# EAGLE design GC+ (EAGLE 7.4.0)
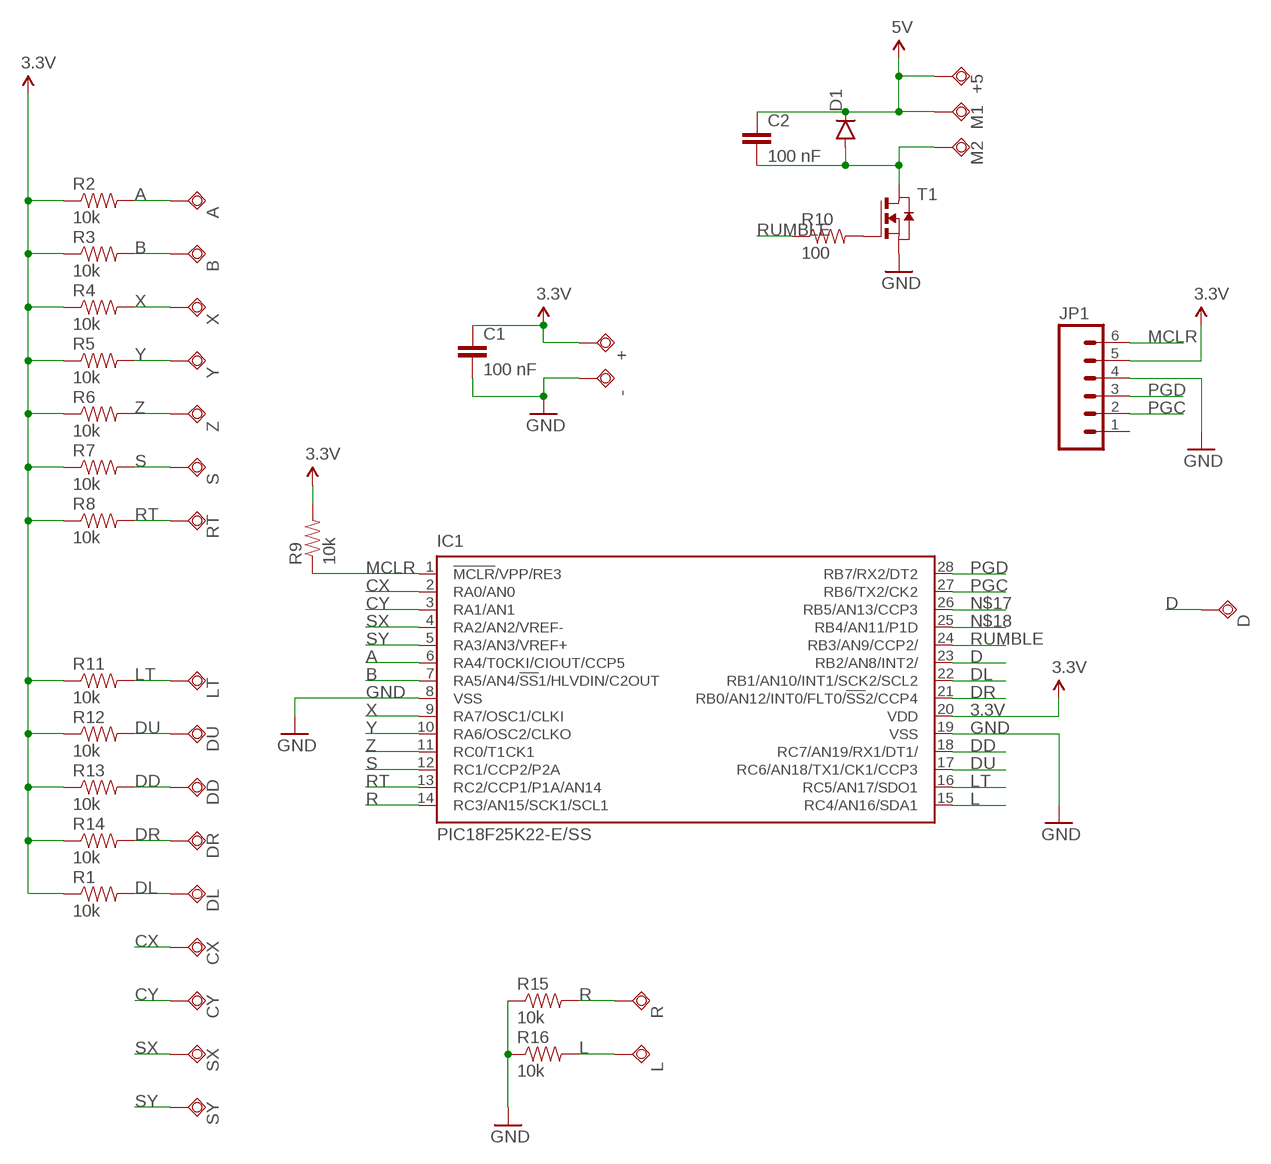
[diagram p0: schematic, sheet 1]

## Parts
+  TPSQTP10SQ  [TP10SQ]
+5  TPSQTP10SQ  [TP10SQ]
-  TPSQTP10SQ  [TP10SQ]
A  TPSQTP10SQ  [TP10SQ]
B  TPSQTP10SQ  [TP10SQ]
C1  100 nF  CAP0805  [0805]
C2  100 nF  CAP0805  [0805]
CX  TPSQTP10SQ  [TP10SQ]
CY  TPSQTP10SQ  [TP10SQ]
D  TPSQTP10SQ  [TP10SQ]
D1  DIODEBAS16  [SOD-323]
DD  TPSQTP10SQ  [TP10SQ]
DL  TPSQTP10SQ  [TP10SQ]
DR  TPSQTP10SQ  [TP10SQ]
DU  TPSQTP10SQ  [TP10SQ]
IC1  PIC18F25K22-E/SS  [SSOP28]
JP1  M06SILK_FEMALE_PTH  [1X06]
L  TPSQTP10SQ  [TP10SQ]
LT  TPSQTP10SQ  [TP10SQ]
M1  TPSQTP10SQ  [TP10SQ]
M2  TPSQTP10SQ  [TP10SQ]
R  TPSQTP10SQ  [TP10SQ]
R1  10k  RESISTOR0805-RES  [0805]
R2  10k  RESISTOR0805-RES  [0805]
R3  10k  RESISTOR0805-RES  [0805]
R4  10k  RESISTOR0805-RES  [0805]
R5  10k  RESISTOR0805-RES  [0805]
R6  10k  RESISTOR0805-RES  [0805]
R7  10k  RESISTOR0805-RES  [0805]
R8  10k  RESISTOR0805-RES  [0805]
R9  10k  RESISTOR0805-RES  [0805]
R10  100  RESISTOR0805-RES  [0805]
R11  10k  RESISTOR0805-RES  [0805]
R12  10k  RESISTOR0805-RES  [0805]
R13  10k  RESISTOR0805-RES  [0805]
R14  10k  RESISTOR0805-RES  [0805]
R15  10k  RESISTOR0805-RES  [0805]
R16  10k  RESISTOR0805-RES  [0805]
RT  TPSQTP10SQ  [TP10SQ]
S  TPSQTP10SQ  [TP10SQ]
SX  TPSQTP10SQ  [TP10SQ]
SY  TPSQTP10SQ  [TP10SQ]
T1  NMOSSOT23  [SOT-23]
X  TPSQTP10SQ  [TP10SQ]
Y  TPSQTP10SQ  [TP10SQ]
Z  TPSQTP10SQ  [TP10SQ]

## Nets
3.3V: +.TP C1.1 IC1.20(VDD) JP1.5 R1.1 R2.1 R3.1 R4.1 R5.1 R6.1 R7.1 R8.1 R9.2 R11.1 R12.1 R13.1 R14.1
5V: +5.TP C2.1 D1.C M1.TP
A: A.TP IC1.6(RA4/T0CKI/CIOUT/CCP5) R2.2
B: B.TP IC1.7(RA5/AN4/!SS!1/HLVDIN/C2OUT) R3.2
CX: CX.TP IC1.2(RA0/AN0)
CY: CY.TP IC1.3(RA1/AN1)
D: D.TP IC1.23(RB2/AN8/INT2/)
DD: DD.TP IC1.18(RC7/AN19/RX1/DT1/) R13.2
DL: DL.TP IC1.22(RB1/AN10/INT1/SCK2/SCL2) R1.2
DR: DR.TP IC1.21(RB0/AN12/INT0/FLT0/!SS!2/CCP4) R14.2
DU: DU.TP IC1.17(RC6/AN18/TX1/CK1/CCP3) R12.2
GND: -.TP C1.2 IC1.8(VSS) IC1.19(VSS) JP1.4 R15.1 R16.1 T1.2(S)
L: IC1.15(RC4/AN16/SDA1) L.TP R16.2
LT: IC1.16(RC5/AN17/SDO1) LT.TP R11.2
MCLR: IC1.1(!MCLR!/VPP/RE3) JP1.6 R9.1
N$1: R10.2 T1.3(G)
N$3: C2.2 D1.A M2.TP T1.1(D)
N$17: IC1.26(RB5/AN13/CCP3)
N$18: IC1.25(RB4/AN11/P1D)
PGC: IC1.27(RB6/TX2/CK2) JP1.2
PGD: IC1.28(RB7/RX2/DT2) JP1.3
R: IC1.14(RC3/AN15/SCK1/SCL1) R15.2 R.TP
RT: IC1.13(RC2/CCP1/P1A/AN14) R8.2 RT.TP
RUMBLE: IC1.24(RB3/AN9/CCP2/) R10.1
S: IC1.12(RC1/CCP2/P2A) R7.2 S.TP
SX: IC1.4(RA2/AN2/VREF-) SX.TP
SY: IC1.5(RA3/AN3/VREF+) SY.TP
X: IC1.9(RA7/OSC1/CLKI) R4.2 X.TP
Y: IC1.10(RA6/OSC2/CLKO) R5.2 Y.TP
Z: IC1.11(RC0/T1CK1) R6.2 Z.TP
Unconnected: JP1.1

## Library data of the parts
+ +5 - A B CX CY D DD DL DR DU L LT M1 M2 R RT S SX SY X Y Z = testpad:TPSQ: Test pad
C1 C2 = SparkFun-Capacitors:CAP: Capacitor Standard 0603 ceramic capacitor, and 0.1" leaded capacitor.
D1 = SparkFun-DiscreteSemi:DIODE: Diode These are standard reverse protection diodes and small signal diodes. SMA package can handle up to about 1A. SOD-323 can handle about 200mA. What the SOD-323 package when ordering, there are some mfgs out there that are 5-pin packages.; PROD_ID: DIO-09646; VALUE: 250mA/100V
IC1 = pic18f25k22:PIC18F25K22: PIC18F25K22 28 pin DIP
JP1 = SparkFun-Connectors:M06: Header 6 Standard 6-pin 0.1" header. Use with straight break away headers (SKU : PRT-00116), right angle break away headers (PRT-00553), swiss pins (PRT-00743), machine pins (PRT-00117), and female headers (PRT-00115). Molex polarized connector foot print use with SKU : PRT-08094 with associated crimp pins and housings. NOTES ON THE VARIANTS LOCK and LOCK_LONGPADS... This footprint was designed to help hold the alignment of a through-hole component (i.e. 6-pin header) while soldering it into place. You may notice that each hole has been shifted either up or down by 0.005 of an inch from it's more standard position (which is a perfectly straight line). This slight alteration caused the pins (the squares in the middle) to touch the edges of the holes. Because they are alternating, it causes a "brace" to hold the component in place. 0.005 has proven to be the perfect amount of "off-center" position when using our standard breakaway headers. Although looks a little odd when you look at the bare footprint, once you have a header in there, the alteration is very hard to notice. Also,if you push a header all the way into place, it is covered up entirely on the bottom side. This idea of altering the position of holes to aid alignment will be further integrated into the Sparkfun Library for other footprints. It can help hold any component with 3 or more connection pins.; PROD_ID: CONN-08437
R1-R16 = SparkFun-Passives:RESISTOR: Resistor Basic schematic elements and footprints for 0603, 1206, and PTH resistors.
T1 = zetex:NMOSSOT23: MOS FET; OC_FARNELL: unknown; OC_NEWARK: unknown

## Board
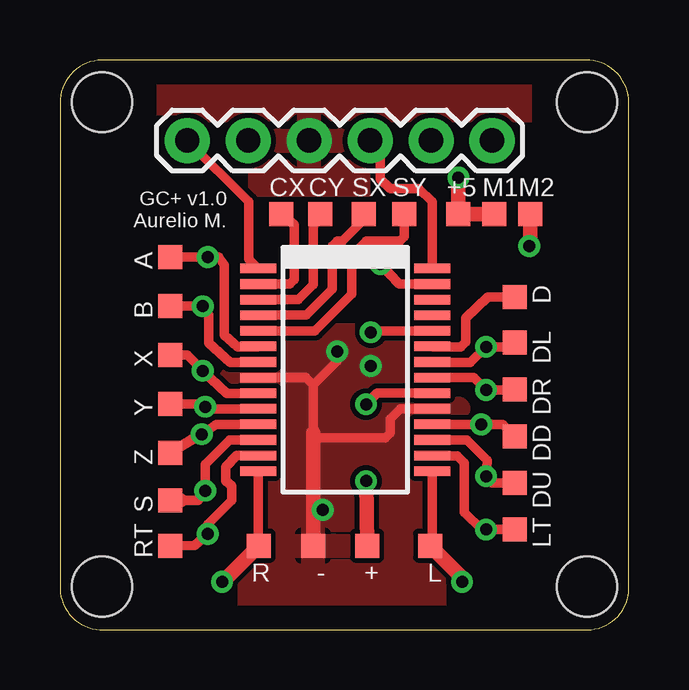
[diagram p1: board, top side]
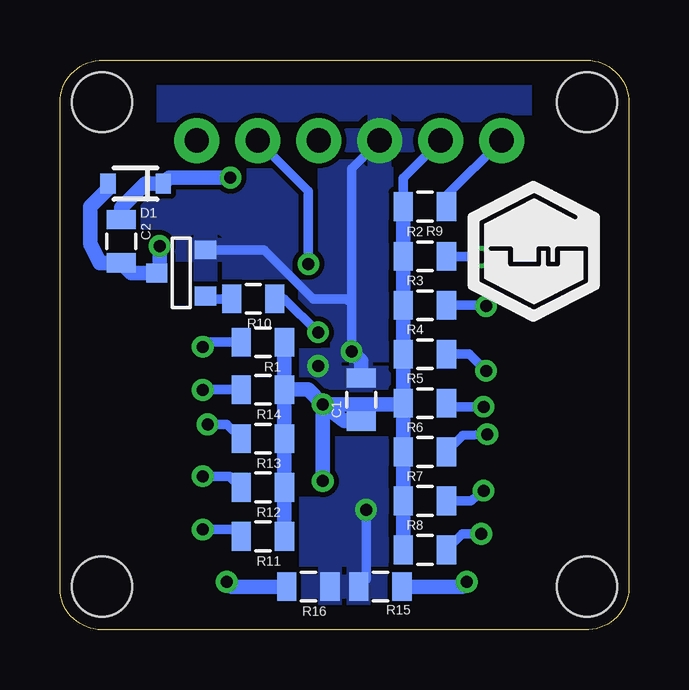
[diagram p2: board, bottom side, seen from below]

Size 23.7 x 23.76 mm. Coordinates in mm from the lower left corner, seen from the top.
Outline: 0,21.95 0,1.86 arc90 1.66,0 21.97,0 arc90 23.7,1.73 23.7,22.14 arc90 21.74,23.75 1.75,23.75 arc90 0,21.95
Copper layers (1*16): Top 0.035mm / dielectric 1.5mm / Bottom 0.035mm
Design rules "default *": minimum track width 10mil, minimum drill 24mil, track to track 8mil, track to pad 8mil, pad to pad 8mil, via to via 8mil, smd to smd 8mil, copper to edge 40mil, drill to drill 8mil, minimum pad ring 10mil, minimum via ring 8mil, stop-mask expansion 4mil, vias tented up to drill 20mil, thermal gap 10mil
Holes 2.5 mm at 21.95,22 1.75,22 1.75,1.8 21.95,1.8

### Footprints (pad centres in the part's own frame; a part is rotated, then mirrored left to right if it is on the bottom)
TP10SQ = smd 1 x 1: TP 0,0
0805 = smd 0.8 x 1.2: 1 -0.9,0; 2 0.9,0
SOD-323 = smd 0.63 x 0.83: A 1.15,0; C -1.15,0
SSOP28 = smd 0.4 x 1.5: 1 -4.225,-3.625; 2 -3.575,-3.625; 3 -2.925,-3.625; 4 -2.275,-3.625; 5 -1.625,-3.625; 6 -0.975,-3.625; 7 -0.325,-3.625; 8 0.325,-3.625; 9 0.975,-3.625; 10 1.625,-3.625; 11 2.275,-3.625; 12 2.925,-3.625; 13 3.575,-3.625; 14 4.225,-3.625; 15 4.225,3.625; 16 3.575,3.625; 17 2.925,3.625; 18 2.275,3.625; 19 1.625,3.625; 20 0.975,3.625; 21 0.325,3.625; 22 -0.325,3.625; 23 -0.975,3.625; 24 -1.625,3.625; 25 -2.275,3.625; 26 -2.925,3.625; 27 -3.575,3.625; 28 -4.225,3.625
1X06 = drill 1.016 pad 1.88: 1 0,0; 2 2.54,0; 3 5.08,0; 4 7.62,0; 5 10.16,0; 6 12.7,0
SOT-23 = smd 0.787 x 0.889: 1 0.025,-1.016; 2 -0.94,1.016; 3 0.991,1.016

### Placement (x,y rotation side)
+  12.8,3.5 180 top
+5  16.6,17.33 0 top
-  10.55,3.5 180 top
A  4.6,15.54 90 top
B  4.6,13.49 90 top
C1  11.15,9.6 90 bottom
C2  21.15,16.2 270 bottom
CX  9.21,17.33 0 top
CY  10.85,17.33 0 top
D  18.95,13.87 270 top
D1  20.55,18.6 180 bottom
DD  18.95,8.06 270 top
DL  18.95,11.97 270 top
DR  18.95,10.02 270 top
DU  18.95,6.12 270 top
IC1  11.88,10.84 270 top
JP1  18,20.4 180 top
L  15.42,3.5 180 top
LT  18.95,4.18 270 top
M1  18.1,17.33 0 top
M2  19.6,17.33 0 top
R  8.27,3.5 180 top
R1  15.25,11.99 180 bottom
R2  8.5,15.57 0 bottom
R3  8.5,13.53 0 bottom
R4  8.5,11.49 0 bottom
R5  8.5,9.45 0 bottom
R6  8.5,7.41 0 bottom
R7  8.5,5.37 0 bottom
R8  8.5,3.33 0 bottom
R9  8.5,17.65 180 bottom
R10  15.65,13.8 180 bottom
R11  15.25,3.89 180 bottom
R12  15.25,5.93 180 bottom
R13  15.25,7.97 180 bottom
R14  15.25,10.01 180 bottom
R15  10.35,1.8 0 bottom
R16  13.35,1.8 180 bottom
RT  4.6,3.5 90 top
S  4.6,5.39 90 top
SX  12.66,17.33 0 top
SY  14.35,17.33 0 top
T1  18.65,14.9 270 bottom
U$1  [LOGOGC]  4.05,15.7 0 top
X  4.6,11.45 90 top
Y  4.6,9.41 90 top
Z  4.6,7.37 90 top

### Tracks (layer width: path | path; a pad name or v marks a point on that pad's centre or on a via)
3.3V  (via drill 0.5)
  Top 0.4: v12.75,9.4 13.22,9.86 IC1.20
  Top 0.61: +.TP v12.75,6.2
  Bottom 0.4: JP1.5 9.4,18.84 R9.2
  Bottom 0.61: R14.1 13.36,10.01 v12.75,9.4 | R8.1 R7.1 R6.1 R5.1 | R5.1 R4.1 R3.1 R2.1 R9.2 | R12.1 R11.1 R13.1 R14.1 | v12.75,9.4 9.45,9.4 R5.1 | v12.75,6.2 v12.75,9.4 | C1.1 11.85,8.7 v12.75,9.4 | R1.1 R14.1
5V  (via drill 0.5)
  Top 0.6: +5.TP v16.6,18.85
  Top 0.61: M1.TP +5.TP
  Bottom 0.6: v16.6,18.85 19.15,18.85 D1.C 20.15,18.6 21.15,17.6 C2.1
A  (via drill 0.5)
  Top 0.4: IC1.6 8.24,11.8 7.4,11.8 6.85,12.3 6.85,15.2 6.61,15.54 v6.15,15.54 A.TP
  Bottom 0.4: R2.2 6.18,15.57 v6.15,15.54
B  (via drill 0.5)
  Top 0.4: IC1.7 8.17,11.15 7.1,11.15 6.2,11.95 6.2,13.15 6.06,13.49 v5.95,13.49 B.TP
  Bottom 0.4: R3.2 5.99,13.53 v5.95,13.49
CX
  Top 0.4: CX.TP 9.75,16.89 9.75,14.6 9.57,14.41 IC1.2
CY
  Top 0.4: CY.TP 10.55,16.83 10.55,14.4 9.92,13.77 IC1.3
D
  Top 0.4: D.TP 17.82,13.87 16.9,13 16.9,12 16.7,11.8 15.52,11.8 IC1.23
DD  (via drill 0.5)
  Top 0.4: IC1.18 v17.55,8.57 18.45,8.57 DD.TP
  Bottom 0.4: v17.55,8.57 16.75,8.57 R13.2
DL  (via drill 0.5)
  Top 0.4: IC1.22 15.52,11.15 17.1,11.15 v17.75,11.8 | v17.75,11.8 18.58,11.8 | v17.75,11.8 18.78,11.8 DL.TP
  Bottom 0.4: R1.2 17.56,11.99 v17.75,11.8
DR  (via drill 0.5)
  Top 0.4: IC1.21 17.24,10.52 v17.75,10 18.93,10 DR.TP
  Bottom 0.4: R14.2 v17.74,10.01 v17.75,10
DU  (via drill 0.5)
  Top 0.4: IC1.17 16.96,7.91 17.8,7.07 v17.75,6.4 17.98,6.12 DU.TP
  Bottom 0.4: v17.75,6.4 16.62,6.4 R12.2
GND  (via drill 0.5)
  Top 0.4: IC1.8 10.24,10.52 10.55,10.2 | 10.55,10.2 10.55,8.2 | IC1.19 14.17,9.21 13.75,8.8 13.75,8.2 13.55,8 10.55,8 | v11.55,11.6 11.55,11.2 10.55,10.2 | v10.95,5 10.55,4.6 10.55,3.6
  Top 0.61: -.TP 10.55,3.6 10.55,8 10.55,8.2
  Bottom 0.4: JP1.4 11.55,19.23 11.55,13.6 | 11.55,13.6 v11.55,11.6 | T1.2 15.19,15.84 13.15,13.8 11.75,13.8 11.55,13.6 | R15.1 10.95,2.1 v10.95,5
  Bottom 0.61: C1.2 11.15,11.2 v11.55,11.6
  other vias: 12.95,11
  pour Top: -1.25,27 25.75,27 25.75,-2 -1.25,-2
  pour Bottom: -4.25,30 28.75,30 28.75,-6 -4.25,-6
L  (via drill 0.5)
  Top 0.4: L.TP 15.51,3.55 IC1.15
  Top 0.6: L.TP 16.75,2.17 v16.75,2
  Bottom 0.6: v16.75,2 16.55,1.8 R16.2
LT  (via drill 0.5)
  Top 0.4: IC1.16 15.57,7.25 16.55,7.25 16.85,6.95 16.85,4.9 17.57,4.18 v17.75,4.18 LT.TP
  Bottom 0.4: v17.75,4.18 16.44,4.18 R11.2
MCLR
  Top 0.4: JP1.6 7.86,17.84 7.86,15.47 IC1.1
  Bottom 0.4: R9.1 7.6,18.1 JP1.6
N$1
  Bottom 0.4: T1.3 17.34,13.8 R10.2
N$3  (via drill 0.5)
  Top 0.61: v19.55,16 19.6,16.05 M2.TP
  Bottom 0.6: T1.1 20.73,14.88 C2.2 22.05,15.3 22.45,16.1 22.45,17.65 21.7,18.4 D1.A
  Bottom 0.61: T1.1 19.55,14.99 v19.55,16
PGC  (via drill 0.5)
  Top 0.4: IC1.27 14.14,14.41 v13.35,15.25
  Bottom 0.4: v13.35,15.25 13.35,18.29 JP1.2
PGD
  Top 0.4: IC1.28 15.51,17.84 14.95,18.4 13.75,18.4 13.35,18.8 13.35,19.97 JP1.3
R  (via drill 0.5)
  Top 0.4: R.TP 8.26,3.54 IC1.14
  Top 0.6: R.TP 6.77,2 v6.75,2
  Bottom 0.6: v6.75,2 6.95,1.8 R15.2
RT  (via drill 0.5)
  Top 0.4: RT.TP 5.62,3.52 v6.15,4 6.15,4.4 7.15,5.4 7.15,6 6.9,6.2 6.9,6.8 7.37,7.27 IC1.13
  Bottom 0.4: R8.2 6.93,4 v6.15,4
RUMBLE  (via drill 0.5)
  Top 0.4: v12.95,12.4 13.02,12.46 IC1.24
  Bottom 0.4: R10.1 14.35,13.8 v12.95,12.4
S  (via drill 0.5)
  Top 0.4: IC1.12 7.07,7.91 6.05,6.9 v6.05,5.8 | v6.05,5.8 5.75,5.4 5.01,5.4 | v6.05,5.8 5.74,5.39
  Top 0.61: 5.01,5.4 4.81,5.4 S.TP
  Bottom 0.4: v6.05,5.8 6.58,5.37 R7.2
SX
  Top 0.4: IC1.4 10.27,13.11 11.35,14.2 11.35,16 11.55,16.2 11.75,16.2 12.66,17.11 SX.TP 12.55,17.22
SY
  Top 0.4: IC1.5 10.62,12.46 12.15,14 12.15,15.6 12.75,16.2 14.15,16.2 14.35,16.4 SY.TP
X  (via drill 0.5)
  Top 0.4: IC1.9 8.19,9.85 6.95,9.85 v5.95,10.8 5.3,11.45 X.TP
  Bottom 0.4: R4.2 6.64,11.49 v5.95,10.8
Y  (via drill 0.5)
  Top 0.4: IC1.10 6.15,9.2 v6.05,9.3 5.94,9.41 Y.TP
  Bottom 0.4: R5.2 7.45,9.3 v6.05,9.3
Z  (via drill 0.5)
  Top 0.4: IC1.11 6.52,8.57 v5.9,8.15 | v5.9,8.15 5.95,8 5.63,8 Z.TP 5.73,8.1 v5.9,8.15
  Bottom 0.4: R6.2 6.91,8.1 v5.9,8.15

### Text on the board
tPlace: GC+ v1.0 / Aurelio M.